# EAGLE schematic roller-shutter (EAGLE 9.6.2)
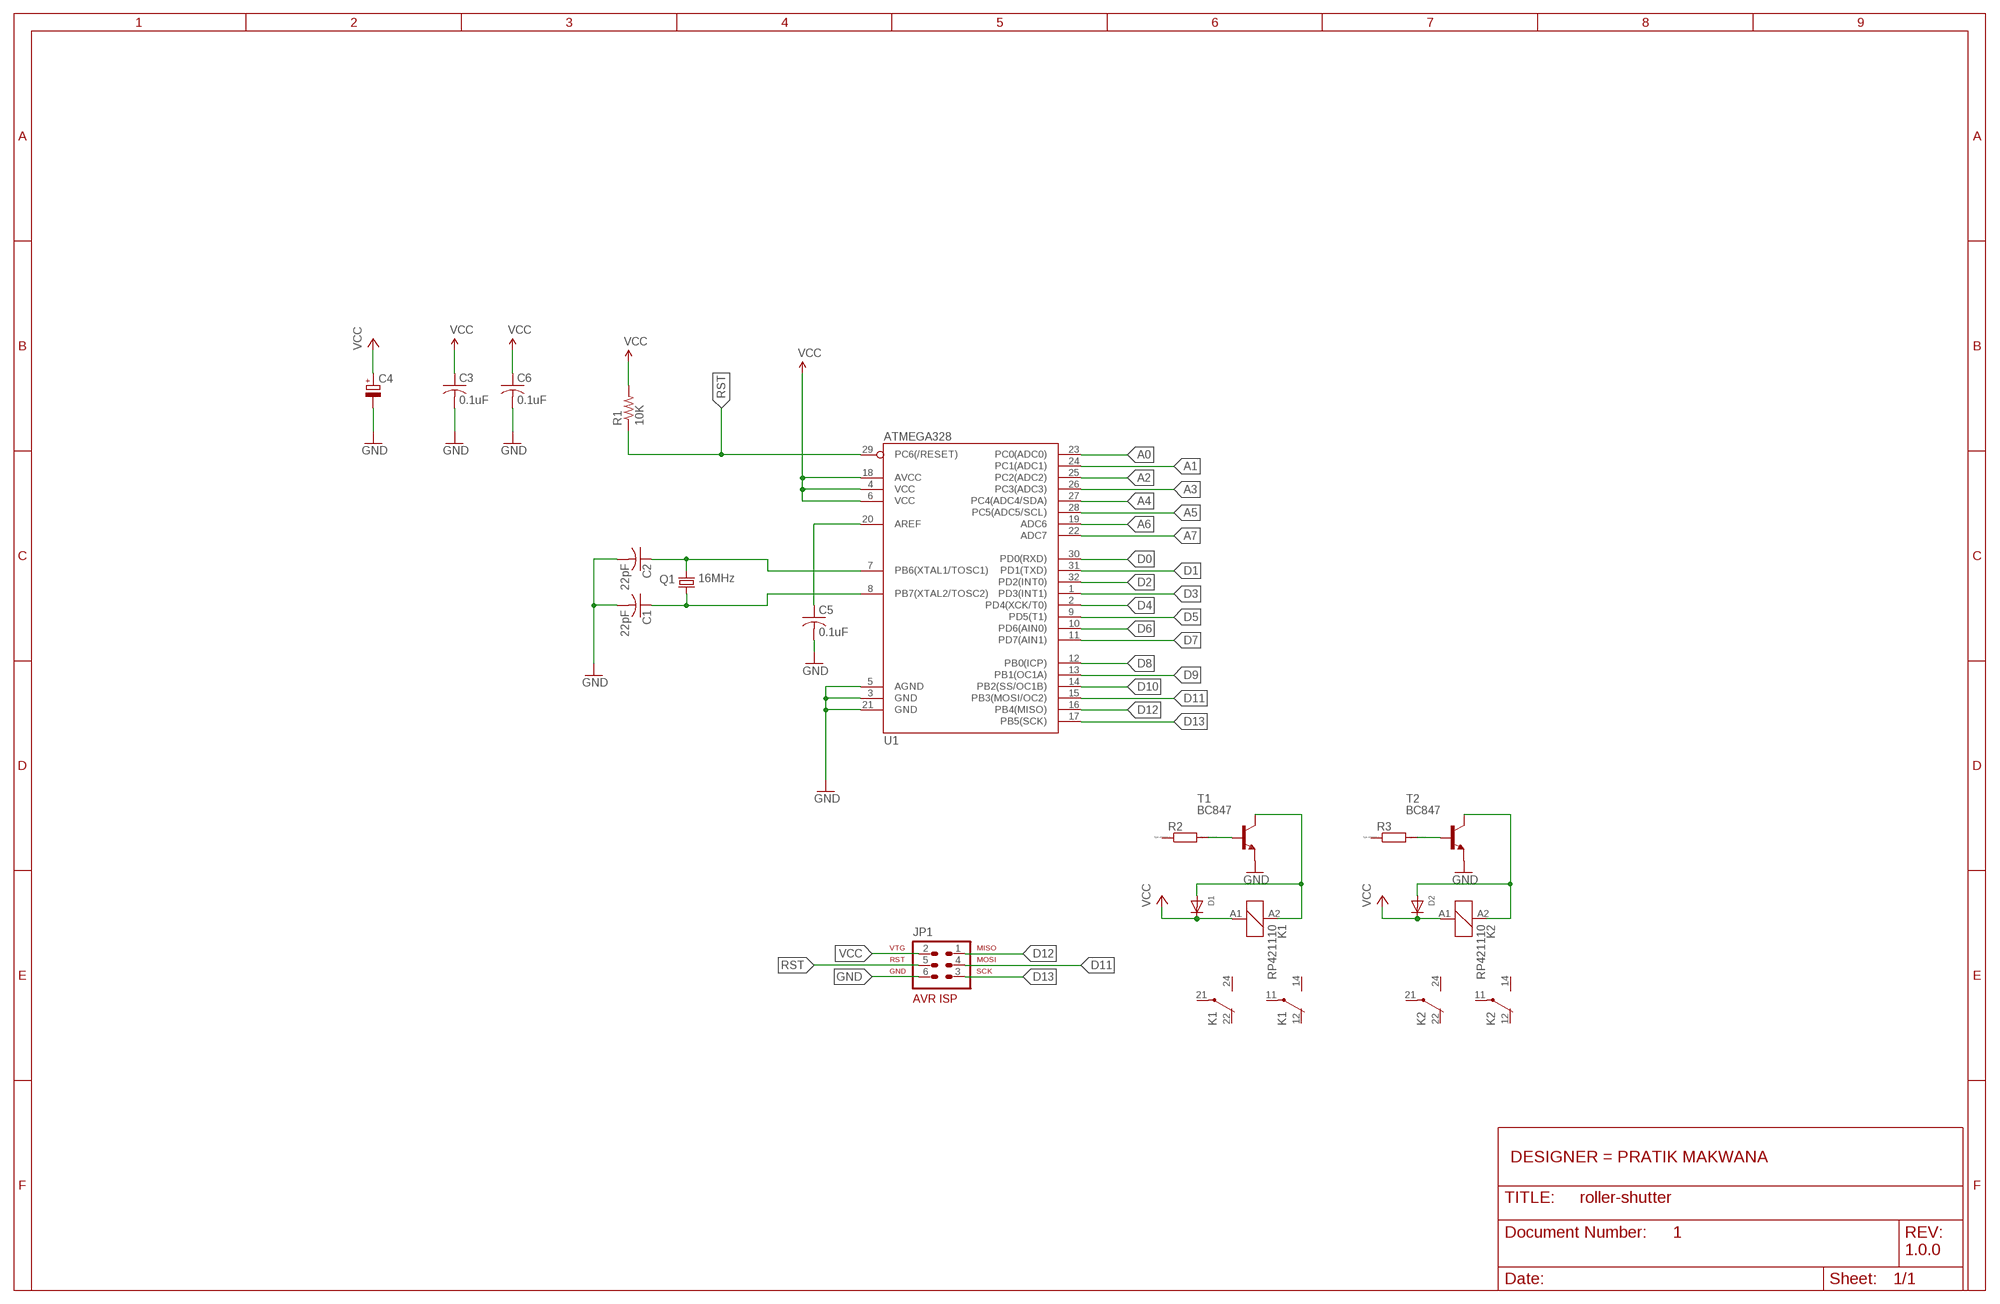
[diagram p0: schematic, sheet 1]
FRAME1 (FRAME_B_L): DESIGNER: PRATIK MAKWANA; DOC: 1; REV: 1.0.0

## Parts
C1  22pF  C-USC1206  [C1206]
C2  22pF  C-USC1206  [C1206]
C3  0.1uF  C-USC0805  [C0805]
C4  CPOL-EUSANYO_SMD_C6  [SANYO-OSCON_SMD_C6]
C5  0.1uF  C-USC0805  [C0805]
C6  0.1uF  C-USC0805  [C0805]
D1  DIODE_SOD-123FL  [SOD-123FL]
D2  DIODE_SOD-123FL  [SOD-123FL]
JP1  AVR-ISP-6  [AVR-ISP-6]
K1  RP421110  [RP420]
K2  RP421110  [RP420]
Q1  16MHz  CRYTALHC49S  [HC49/S]
R1  10K  R-US_R1206  [R1206]
R2  RR1210  [R1210]
R3  RR1210  [R1210]
T1  BC847  [SOT23]
T2  BC847  [SOT23]
U1  ATMEGA328  [TQFP32-08]

## Nets
A0: U1.23(PC0(ADC0))
A1: U1.24(PC1(ADC1))
A2: U1.25(PC2(ADC2))
A3: U1.26(PC3(ADC3))
A4: U1.27(PC4(ADC4/SDA))
A5: U1.28(PC5(ADC5/SCL))
A6: U1.19(ADC6)
A7: U1.22(ADC7)
AREF: C5.1 U1.20(AREF)
D0: U1.30(PD0(RXD))
D1: U1.31(PD1(TXD))
D2: U1.32(PD2(INT0))
D3: U1.1(PD3(INT1))
D4: U1.2(PD4(XCK/T0))
D5: U1.9(PD5(T1))
D6: U1.10(PD6(AIN0))
D7: U1.11(PD7(AIN1))
D8: U1.12(PB0(ICP))
D9: U1.13(PB1(OC1A))
D10: U1.14(PB2(SS/OC1B))
D11: JP1.4 U1.15(PB3(MOSI/OC2))
D12: JP1.1 U1.16(PB4(MISO))
D13: JP1.3 U1.17(PB5(SCK))
GND: C1.2 C2.2 C3.2 C4.- C5.2 C6.2 JP1.6 T1.2(E) T2.2(E) U1.3(GND) U1.5(AGND) U1.21(GND)
N$3: D1.A K1.A2 T1.3(C)
N$4: D2.A K2.A2 T2.3(C)
N$5: R3.2 T2.1(B)
N$6: R2.2 T1.1(B)
N$43: C2.1 Q1.2 U1.7(PB6(XTAL1/TOSC1))
N$44: C1.1 Q1.1 U1.8(PB7(XTAL2/TOSC2))
RST: JP1.5 R1.1 U1.29(PC6(/RESET))
VCC: C3.1 C4.+ C6.1 D1.C D2.C JP1.2 K1.A1 K2.A1 R1.2 U1.4(VCC) U1.6(VCC) U1.18(AVCC)
Unconnected: K1.11(2:P) K1.12(2:O) K1.14(2:S) K1.21(3:P) K1.22(3:O) K1.24(3:S) K2.11(2:P) K2.12(2:O) K2.14(2:S) K2.21(3:P) K2.22(3:O) K2.24(3:S) R2.1 R3.1

## Library data of the parts
C1-C3 C5 C6 = adafruit:C-US: CAPACITOR, American symbol
C4 = rcl:CPOL-EU: POLARIZED CAPACITOR, European symbol; SPICEPREFIX: C
D1 D2 = adafruit:DIODE: Diode SMADIODE - SMA Surface Mount Package 20V 1A Schottky Diode Digikey: 641-1014-6-ND DO-1N4148 - Through Hole Small Current Diode SOD-123 20V 1 A (.5mV Vf) Schottky Diode - Digikey: MBRX120TPMSCT-ND SOD-323 10V 570mA (.38mV Vf, 3ns) Schottky Diode - Digikey: ZLLS410CT-ND SOD-523 30V 30mA Schottky Diode (RB751S-40TE61) - Digikey: RB751S-40TE61CT-ND SOT23-R/W - SOT23 Package (R = Solder Paste/Reflow Ovens, W = Hand-Soldering) BAT54Film 40V 300mA - Digikey: 497-7162-1-ND
JP1 = atmel-1:AVR-ISP-6: AVR ISP-6 Serial Programming Header
K1 K2 = relay:RP42?*: Power PCB Relay RP II/2 Schrack 2 pole 8 A Source: http://www.schrack.com/.. 5844.pdf; MF: TYCO ELECTRONICS; MPN: RP421110; OC_FARNELL: unknown; OC_NEWARK: 39C2625
Q1 = crystal:CRYTAL: CRYSTAL
R1 = adafruit:R-US_: RESISTOR, American symbol
R2 R3 = eagle-ltspice:R: RESISTOR, European symbol; SPICEMODEL: NONE; SPICEPREFIX: R
T1 T2 = transistor:BC847: NPN TRANSISTOR
U1 = thecustomgeek:ATMEGA328: ATmega328P-AU TQFP 32 pin